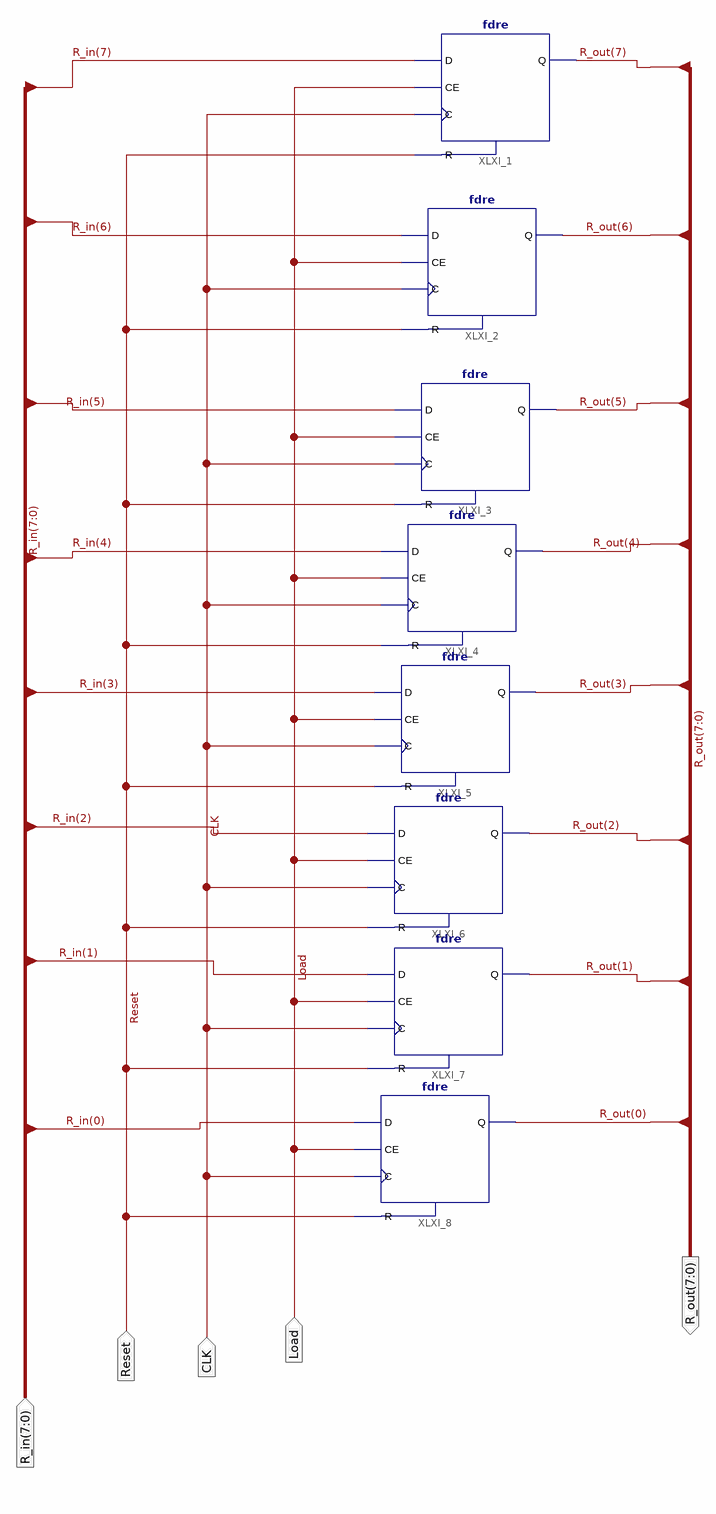
[diagram p0: schematic sheet 1]
// Xilinx ISE schematic register_8bit.sch (spartan3e) as structural Verilog: 8 symbols, 5 ports
module register_8bit (
  input  Load,
  input  CLK,
  input  Reset,
  input  [7:0] R_in,
  output [7:0] R_out
);

  fdre XLXI_1 (.C(CLK), .CE(Load), .D(R_in[7]), .R(Reset), .Q(R_out[7]));
  fdre XLXI_2 (.C(CLK), .CE(Load), .D(R_in[6]), .R(Reset), .Q(R_out[6]));
  fdre XLXI_3 (.C(CLK), .CE(Load), .D(R_in[5]), .R(Reset), .Q(R_out[5]));
  fdre XLXI_4 (.C(CLK), .CE(Load), .D(R_in[4]), .R(Reset), .Q(R_out[4]));
  fdre XLXI_5 (.C(CLK), .CE(Load), .D(R_in[3]), .R(Reset), .Q(R_out[3]));
  fdre XLXI_6 (.C(CLK), .CE(Load), .D(R_in[2]), .R(Reset), .Q(R_out[2]));
  fdre XLXI_7 (.C(CLK), .CE(Load), .D(R_in[1]), .R(Reset), .Q(R_out[1]));
  fdre XLXI_8 (.C(CLK), .CE(Load), .D(R_in[0]), .R(Reset), .Q(R_out[0]));
endmodule
